# Altium schematic sheet pakiet_schemat.SchDoc
size A4; SheetNumber: 1; SheetTotal: 1
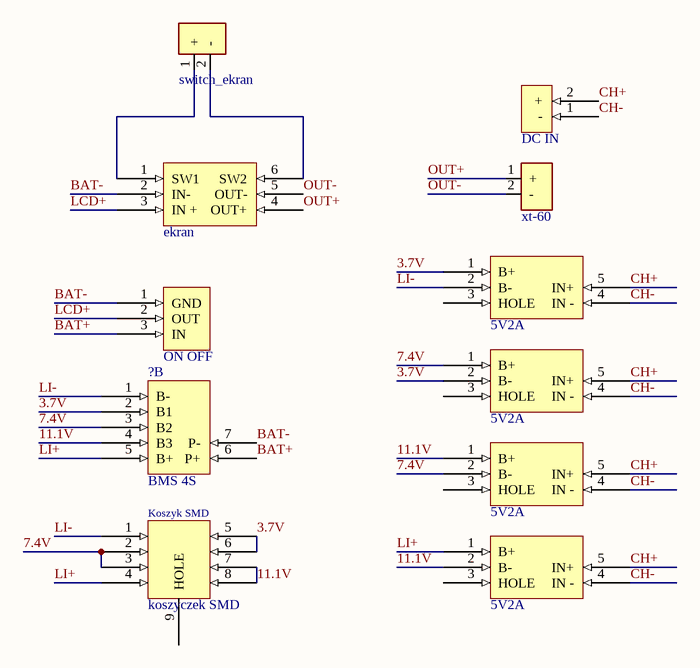
[diagram p0: pakiet_schemat.SchDoc]

## Parts
(Parts that share a designator on the sheet are numbered #1, #2 ... from top to bottom, then left to right.)
*?  ON OFF  [ON OFF]
?#1  switch_ekran  [switch_ekran]
?#2  DC IN  [DC_IN]
?#3  ekran  [ekran]
?#4  xt-60  [xt60]
?#5  5V2A  [5V2A charger]
?#6  BMS 4S  [BMS 4S]  (part B of 2)
?#7  5V2A  [5V2A charger]
?#8  koszyczek SMD  [koszyk SMD]
?#9  5V2A  [5V2A charger]
Charger_1  5V2A  [5V2A charger]

## Nets
3.7V: ?#5.2(B-) ?#6.2(B1) ?#8.5 ?#8.6 Charger_1.1(B+)
7.4V: ?#5.1(B+) ?#6.3(B2) ?#7.2(B-) ?#8.2 ?#8.3
11.1V: ?#6.4(B3) ?#7.1(B+) ?#8.7 ?#8.8 ?#9.2(B-)
BAT+: *?.3(IN) ?#6.6(P+)
BAT-: *?.1(GND) ?#3.2(IN-) ?#6.7(P-)
CH+: ?#2.2(+) ?#5.5(IN+) ?#7.5(IN+) ?#9.5(IN+) Charger_1.5(IN+)
CH-: ?#2.1(-) ?#5.4(IN_-) ?#7.4(IN_-) ?#9.4(IN_-) Charger_1.4(IN_-)
LCD+: *?.2(OUT) ?#3.3(IN_+)
LI+: ?#6.5(B+) ?#8.4 ?#9.1(B+)
LI-: ?#6.1(B-) ?#8.1 Charger_1.2(B-)
OUT+: ?#3.4(OUT+) ?#4.1(+)
OUT-: ?#3.5(OUT-) ?#4.2(-)
Net?#1_1: ?#1.1(+) ?#3.1(SW1)
Net?#1_2: ?#1.2(-) ?#3.6(SW2)

Not connected (* = marked no-connect by the designer): ?#5 3(HOLE); ?#7 3(HOLE); ?#8 9(HOLE); ?#9 3(HOLE); Charger_1 3(HOLE)

## Notes on the sheet
- (in symbol koszyczek SMD) Koszyk SMD